# EAGLE schematic Gums (EAGLE 7.6.0)
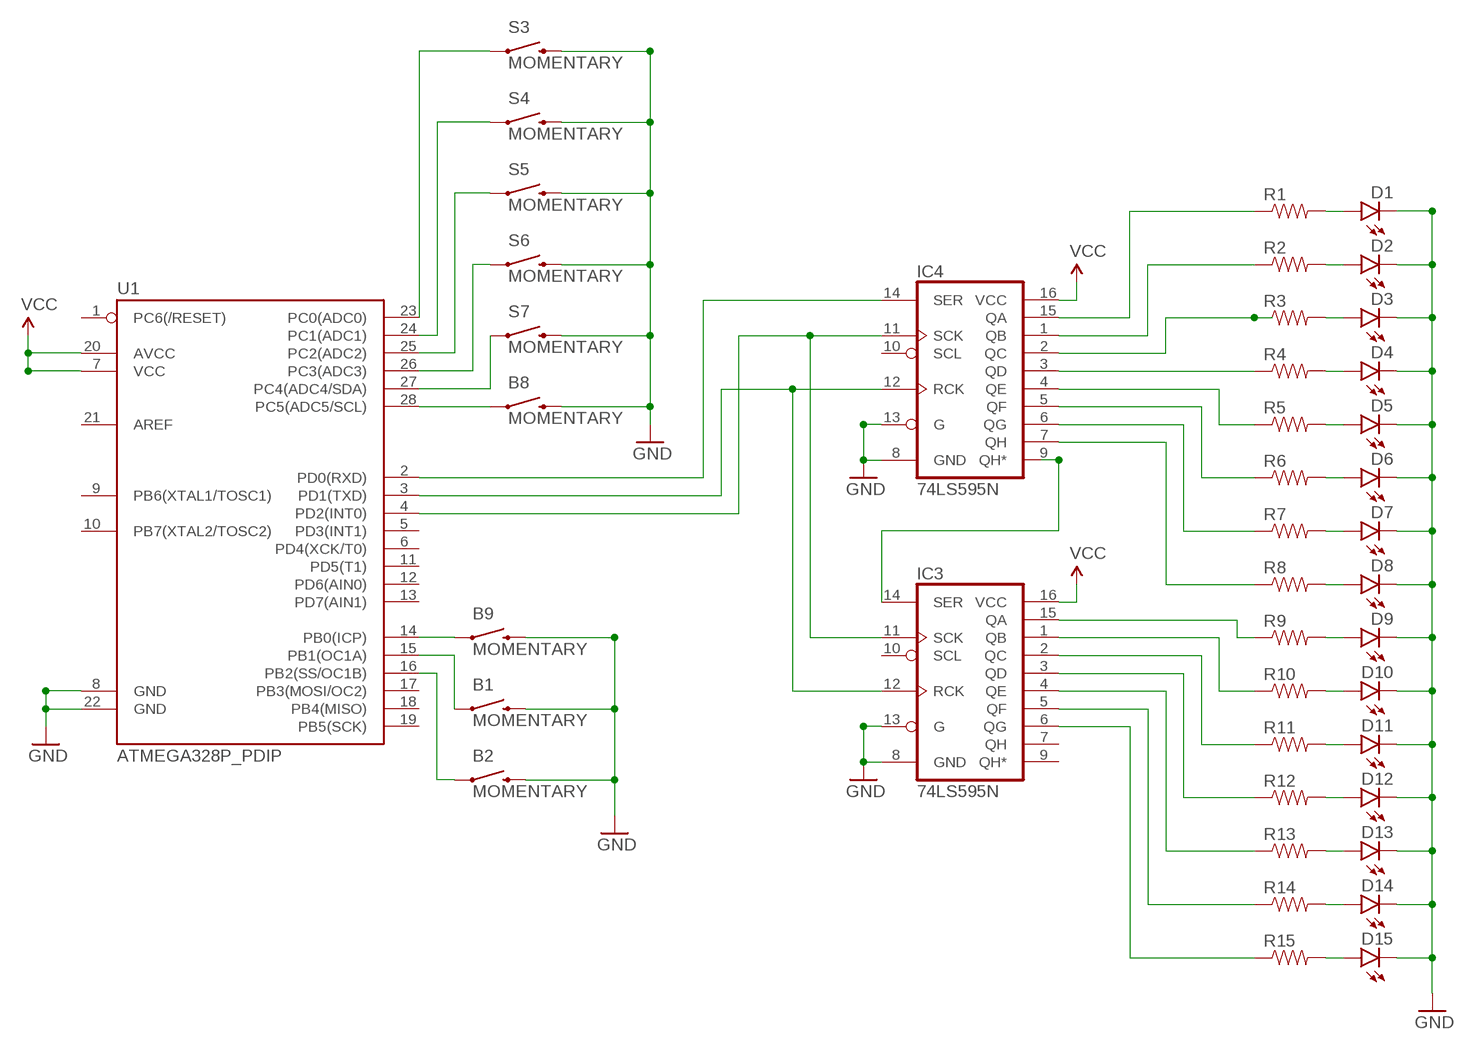
[diagram p0: schematic, sheet 1]

## Parts
B1  MOMENTARY  SWITCH-MOMENTARY-2SMD-12MM  [TACTILE-SMD-12MM]
B2  MOMENTARY  SWITCH-MOMENTARY-2SMD-12MM  [TACTILE-SMD-12MM]
B8  MOMENTARY  SWITCH-MOMENTARY-2SMD-12MM  [TACTILE-SMD-12MM]
B9  MOMENTARY  SWITCH-MOMENTARY-2SMD-12MM  [TACTILE-SMD-12MM]
D1  LED5MM  [LED5MM]
D2  LED5MM  [LED5MM]
D3  LED5MM  [LED5MM]
D4  LED5MM  [LED5MM]
D5  LED5MM  [LED5MM]
D6  LED5MM  [LED5MM]
D7  LED5MM  [LED5MM]
D8  LED5MM  [LED5MM]
D9  LED5MM  [LED5MM]
D10  LED5MM  [LED5MM]
D11  LED5MM  [LED5MM]
D12  LED5MM  [LED5MM]
D13  LED5MM  [LED5MM]
D14  LED5MM  [LED5MM]
D15  LED5MM  [LED5MM]
IC3  74LS595N  [DIL16]
IC4  74LS595N  [DIL16]
R1  RESISTORPTH-1/4W  [AXIAL-0.4]
R2  RESISTORPTH-1/4W  [AXIAL-0.4]
R3  RESISTORPTH-1/4W  [AXIAL-0.4]
R4  RESISTORPTH-1/4W  [AXIAL-0.4]
R5  RESISTORPTH-1/4W  [AXIAL-0.4]
R6  RESISTORPTH-1/4W  [AXIAL-0.4]
R7  RESISTORPTH-1/4W  [AXIAL-0.4]
R8  RESISTORPTH-1/4W  [AXIAL-0.4]
R9  RESISTORPTH-1/4W  [AXIAL-0.4]
R10  RESISTORPTH-1/4W  [AXIAL-0.4]
R11  RESISTORPTH-1/4W  [AXIAL-0.4]
R12  RESISTORPTH-1/4W  [AXIAL-0.4]
R13  RESISTORPTH-1/4W  [AXIAL-0.4]
R14  RESISTORPTH-1/4W  [AXIAL-0.4]
R15  RESISTORPTH-1/4W  [AXIAL-0.4]
S3  MOMENTARY  SWITCH-MOMENTARY-2SMD-12MM  [TACTILE-SMD-12MM]
S4  MOMENTARY  SWITCH-MOMENTARY-2SMD-12MM  [TACTILE-SMD-12MM]
S5  MOMENTARY  SWITCH-MOMENTARY-2SMD-12MM  [TACTILE-SMD-12MM]
S6  MOMENTARY  SWITCH-MOMENTARY-2SMD-12MM  [TACTILE-SMD-12MM]
S7  MOMENTARY  SWITCH-MOMENTARY-2SMD-12MM  [TACTILE-SMD-12MM]
U1  ATMEGA328P_PDIP  [DIL28-3]

## Nets
GND: B1.3 B2.3 B8.3 B9.3 D1.K(C) D2.K(C) D3.K(C) D4.K(C) D5.K(C) D6.K(C) D7.K(C) D8.K(C) D9.K(C) D10.K(C) D11.K(C) D12.K(C) D13.K(C) D14.K(C) D15.K(C) IC3.8(GND) IC3.13(G) IC4.8(GND) IC4.13(G) S3.3 S4.3 S5.3 S6.3 S7.3 U1.8(GND) U1.22(GND)
N$1: B8.1 U1.28(PC5(ADC5/SCL))
N$2: B9.1 U1.14(PB0(ICP))
N$3: B1.1 U1.15(PB1(OC1A))
N$4: B2.1 U1.16(PB2(SS/OC1B))
N$5: S5.1 U1.25(PC2(ADC2))
N$6: S6.1 U1.26(PC3(ADC3))
N$7: S7.1 U1.27(PC4(ADC4/SDA))
N$8: S4.1 U1.24(PC1(ADC1))
N$9: S3.1 U1.23(PC0(ADC0))
N$10: D1.A R1.P$2
N$11: D2.A R2.P$2
N$12: IC4.14(SER) U1.2(PD0(RXD))
N$13: IC3.14(SER) IC4.9(QH*)
N$14: IC3.12(RCK) IC4.12(RCK) U1.3(PD1(TXD))
N$15: IC3.11(SCK) IC4.11(SCK) U1.4(PD2(INT0))
N$16: D3.A R3.P$2
N$17: D4.A R4.P$2
N$18: D5.A R5.P$2
N$19: D6.A R6.P$2
N$20: D7.A R7.P$2
N$21: D8.A R8.P$2
N$22: D9.A R9.P$2
N$23: D10.A R10.P$2
N$24: D11.A R11.P$2
N$25: D12.A R12.P$2
N$26: IC4.15(QA) R1.P$1
N$27: IC4.1(QB) R2.P$1
N$28: IC4.2(QC) R3.P$1
N$29: IC4.3(QD) R4.P$1
N$30: IC4.4(QE) R5.P$1
N$31: IC4.5(QF) R6.P$1
N$32: IC4.6(QG) R7.P$1
N$33: IC4.7(QH) R8.P$1
N$34: IC3.15(QA) R9.P$1
N$35: IC3.1(QB) R10.P$1
N$36: IC3.2(QC) R11.P$1
N$37: IC3.3(QD) R12.P$1
N$47: D13.A R13.P$2
N$48: D14.A R14.P$2
N$49: D15.A R15.P$2
N$50: IC3.4(QE) R13.P$1
N$51: IC3.5(QF) R14.P$1
N$52: IC3.6(QG) R15.P$1
VCC: IC3.16(VCC) IC4.16(VCC) U1.7(VCC) U1.20(AVCC)
Unconnected: IC3.7(QH) IC3.9(QH*) IC3.10(SCL) IC4.10(SCL) U1.1(PC6(/RESET)) U1.5(PD3(INT1)) U1.6(PD4(XCK/T0)) U1.9(PB6(XTAL1/TOSC1)) U1.10(PB7(XTAL2/TOSC2)) U1.11(PD5(T1)) U1.12(PD6(AIN0)) U1.13(PD7(AIN1)) U1.17(PB3(MOSI/OC2)) U1.18(PB4(MISO)) U1.19(PB5(SCK)) U1.21(AREF)

## Library data of the parts
B1 B2 B8 B9 S3-S7 = SparkFun-Electromechanical:SWITCH-MOMENTARY-2: Various NO switches- pushbuttons, reed, etc
D1-D15 = SparkFun-LED:LED: LEDs Standard schematic elements and footprints for 5mm, 3mm, 1206, and 0603 sized LEDs. 5mm - Spark Fun Electronics SKU : COM-00529 (and others)
IC3 IC4 = SparkFun-DigitalIC:74*595: 8-bit SHIFT REGISTER, output latch
R1-R15 = SparkFun-Resistors:RESISTOR: Resistor Basic schematic elements and footprints for 0603, 1206, and PTH resistors.
U1 = SparkFun-DigitalIC:ATMEGA328P_PDIP: uC used in the Arduino 32kb flash, 1k EEPROM, 2k SRAM This is the through-hole version of this chip.